# EAGLE design 04A-015 (EAGLE 9.6.2)
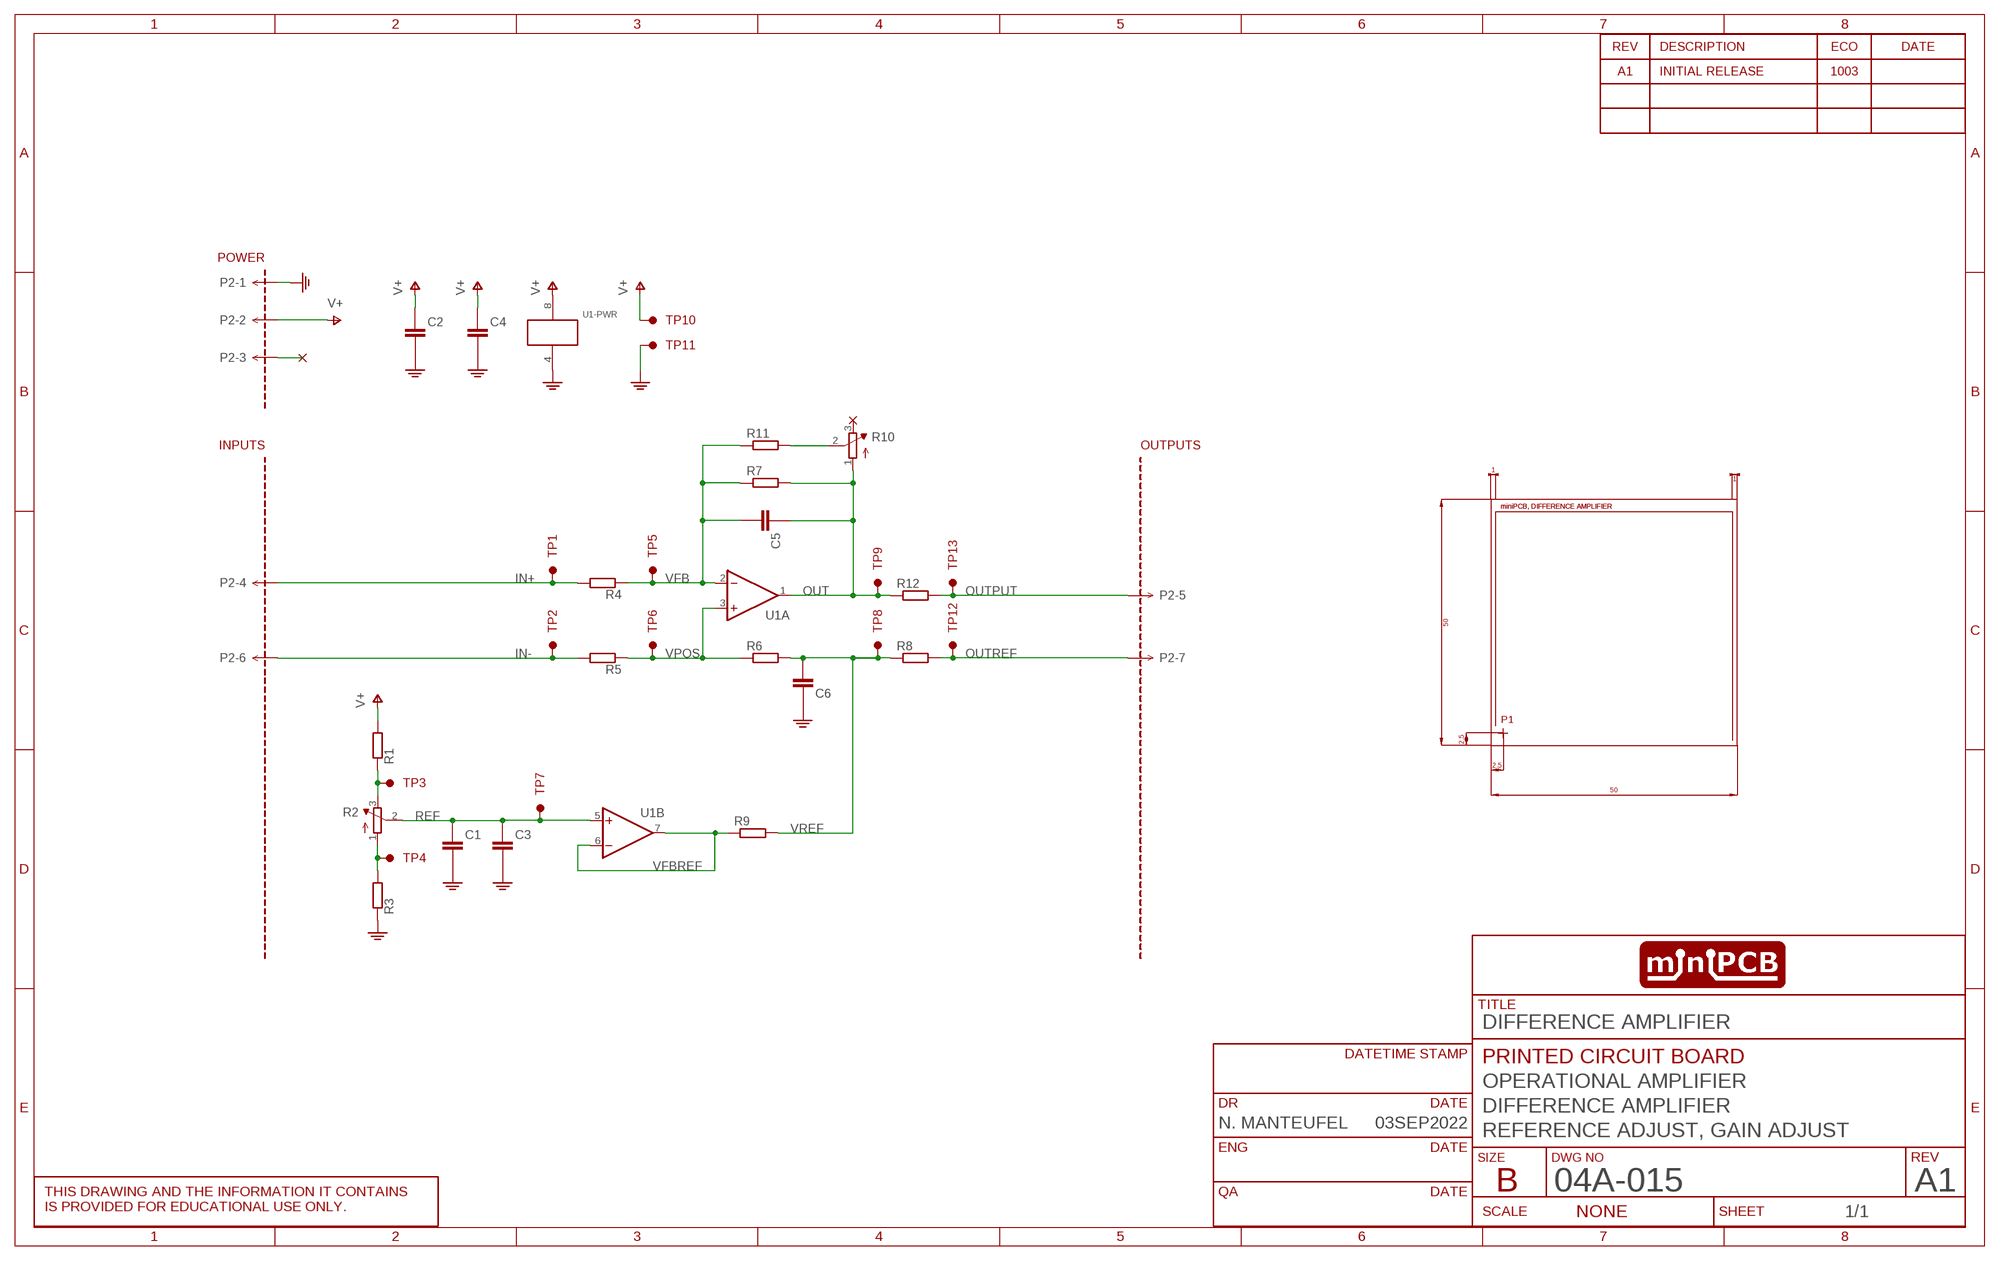
[diagram p0: schematic, sheet 1]
SHEET2 (SCHEMATIC): CIRCUIT_CATEGORY: OPERATIONAL AMPLIFIER; CIRCUIT_NAME: DIFFERENCE AMPLIFIER; CIRCUIT_VARIANT: REFERENCE ADJUST, GAIN ADJUST; DR: N. MANTEUFEL; DR_DATE: 03SEP2022; PCB_PCBA: PRINTED CIRCUIT BOARD; REVA: A1; REVA_ECO: 1003; REVISION: A1; TITLE: DIFFERENCE AMPLIFIER

## Parts
C1  CAPACITORTHD  [C050-024X044]
C2  CAPACITORTHD  [C050-024X044]
C3  CAPACITOR_10  [C5MM]
C4  CAPACITOR_10  [C5MM]
C5  CAPACITORTHD  [C050-024X044]
C6  CAPACITORTHD  [C050-024X044]
P2  MINIPCB_7P  [PINS_1X7]
R1  RESISTOR10MM  [0207/10]
R2  TRIMPOT0.100THD  [TRIM_0100]
R3  RESISTOR10MM  [0207/10]
R4  RESISTOR10MM  [0207/10]
R5  RESISTOR10MM  [0207/10]
R6  RESISTOR10MM  [0207/10]
R7  RESISTOR10MM  [0207/10]
R8  RESISTOR10MM  [0207/10]
R9  RESISTOR10MM  [0207/10]
R10  TRIMPOT0.100THD  [TRIM_0100]
R11  RESISTOR10MM  [0207/10]
R12  RESISTOR10MM  [0207/10]
TP1  TESTPOINTKE5000-SMTEXT  [PINS_1_TESTPOINT_KE5000_NOTEXT]
TP2  TESTPOINTKE5000-SMTEXT  [PINS_1_TESTPOINT_KE5000_NOTEXT]
TP3  TESTPOINTKE5000-SMTEXT  [PINS_1_TESTPOINT_KE5000_NOTEXT]
TP4  TESTPOINTKE5000-SMTEXT  [PINS_1_TESTPOINT_KE5000_NOTEXT]
TP5  TESTPOINTKE5000-SMTEXT  [PINS_1_TESTPOINT_KE5000_NOTEXT]
TP6  TESTPOINTKE5000-SMTEXT  [PINS_1_TESTPOINT_KE5000_NOTEXT]
TP7  TESTPOINTKE5000-SMTEXT  [PINS_1_TESTPOINT_KE5000_NOTEXT]
TP8  TESTPOINTKE5000-SMTEXT  [PINS_1_TESTPOINT_KE5000_NOTEXT]
TP9  TESTPOINTKE5000-SMTEXT  [PINS_1_TESTPOINT_KE5000_NOTEXT]
TP10  TESTPOINTKE5000-SMTEXT  [PINS_1_TESTPOINT_KE5000_NOTEXT]
TP11  TESTPOINTKE5000-SMTEXT  [PINS_1_TESTPOINT_KE5000_NOTEXT]
TP12  TESTPOINTKE5000-SMTEXT  [PINS_1_TESTPOINT_KE5000_NOTEXT]
TP13  TESTPOINTKE5000-SMTEXT  [PINS_1_TESTPOINT_KE5000_NOTEXT]
U1  OPAMP_DUALTHD  [DIL08]
U$1  CLASSIC-50  [PCB50]

## Nets
GND: C1.2(-) C2.2(-) C3.- C4.- C6.1(+) P2.1 R3.1 TP11.1 U1.4(-PWR:V-)
IN+: P2.4 R4.2 TP1.1
IN-: P2.6 R5.2 TP2.1
N$6: R10.2(S) R11.2
NC: P2.3
OUT: C5.1(+) R7.2 R10.1(A) R12.1 TP9.1 U1.1(A:OUT)
OUTPUT: P2.5 R12.2 TP13.1
OUTREF: P2.7 R8.2 TP12.1
P1.1: R2.1(A) R3.2 TP4.1
P1.3: R1.1 R2.3(E) TP3.1
REF: C1.1(+) C3.+ R2.2(S) TP7.1 U1.5(B:+IN)
V+: C2.1(+) C4.+ P2.2 R1.2 TP10.1 U1.8(-PWR:V+)
VFB: C5.2(-) R4.1 R7.1 R11.1 TP5.1 U1.2(A:-IN)
VFBREF: R9.1 U1.6(B:-IN) U1.7(B:OUT)
VPOS: R5.1 R6.1 TP6.1 U1.3(A:+IN)
VREF: C6.2(-) R6.2 R8.1 R9.2 TP8.1
Unconnected: R10.3(E)

## Library data of the parts
C1-C6 = minipcb:CAPACITOR
P2 = minipcb:MINIPCB_7P
R1 R3-R9 R11 R12 = minipcb:RESISTOR
R2 R10 = minipcb:TRIMPOT: SMT trimmer potentiometer part number TC33X http://www.ladyada.net/library/eagle
TP1-TP13 = minipcb:TESTPOINT
U1 = minipcb:OPAMP_DUAL: OP AMP
U$1 = miniPCB_BOARDS:CLASSIC; PART_NUMBER: 04A-015; REVISION: A1-01; TITLE: miniPCB, DIFFERENCE AMPLIFIER

## Board
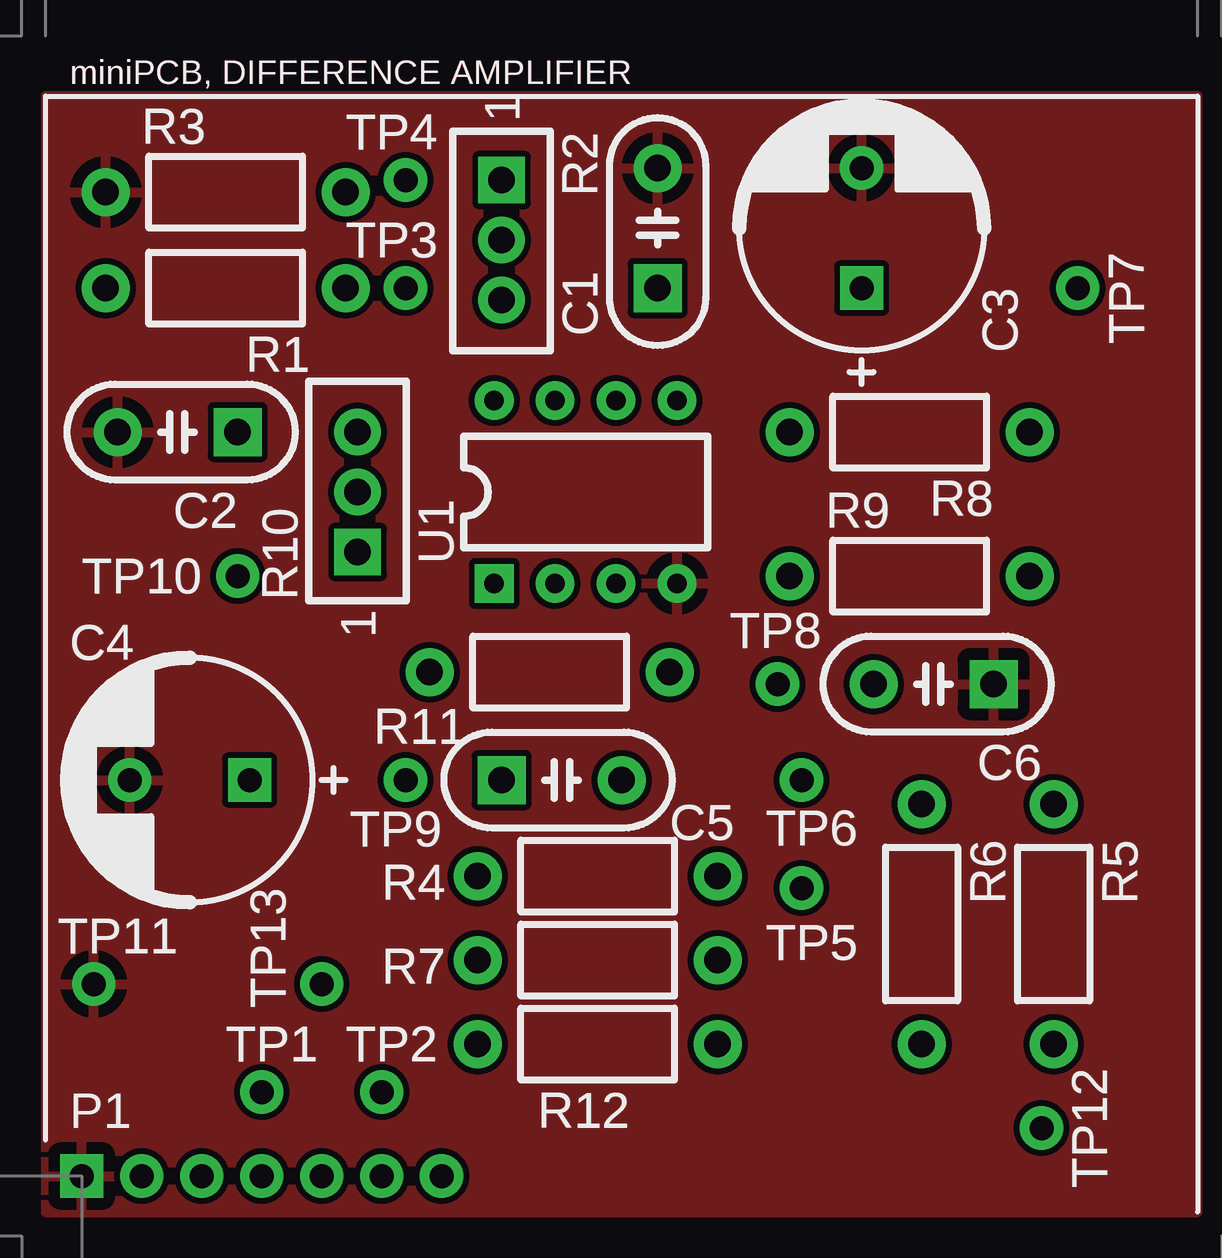
[diagram p1: board, top side]
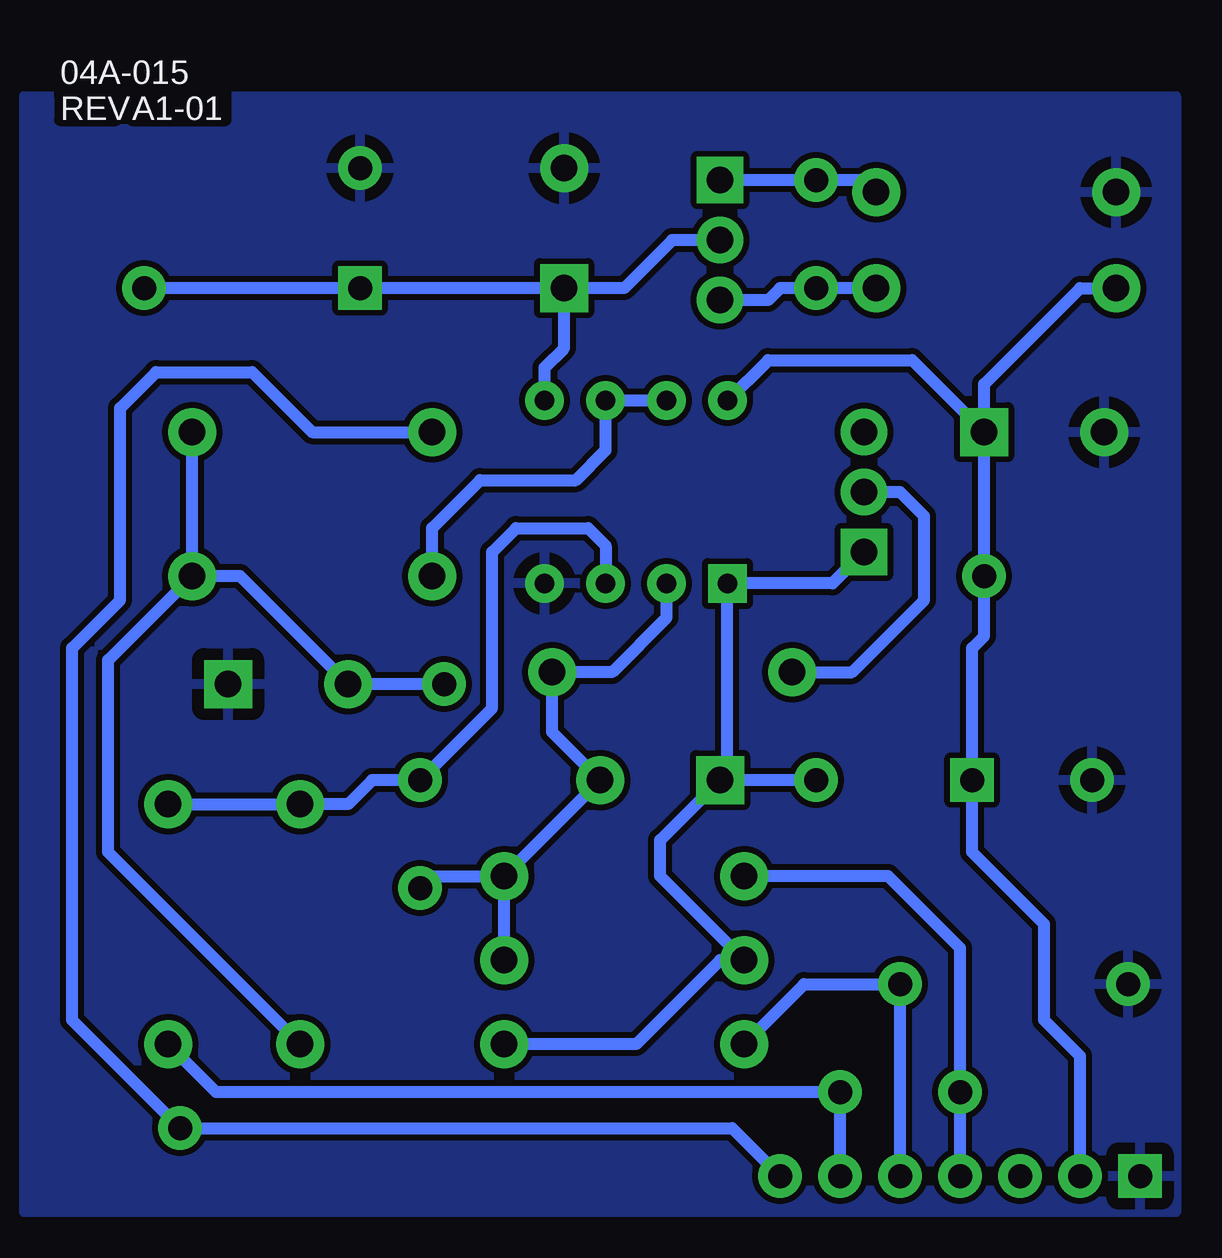
[diagram p2: board, bottom side, seen from below]

No outline drawn. Coordinates in mm, seen from the top.
Copper layers (1*16): Top 0.035mm / dielectric 1.5mm / Bottom 0.035mm
Design rules "minipcb": minimum track width 0.2mm, minimum drill 0.5mm, track to track 0.25mm, track to pad 0.5mm, pad to pad 0.5mm, via to via 0.5mm, smd to smd 0.15mm, copper to edge 1mm, drill to drill 1mm, minimum pad ring 0.4mm, minimum via ring 0.4mm, stop-mask expansion 0.1mm, vias tented up to drill 0.6mm, thermal gap 0.5mm

### Footprints (pad centres in the part's own frame; a part is rotated, then mirrored left to right if it is on the bottom)
C050-024X044 = drill 1.1 pad 2 square: 1 -2.5,0 | drill 1.1 pad 2: 2 2.5,0
C5MM = drill 1 square: + -2.5,0 | drill 1: - 2.5,0
PINS_1X7 = drill 1 square: 1 0,0 | drill 1: 2 2.5,0; 3 5,0; 4 7.5,0; 5 10,0; 6 12.5,0; 7 15,0
0207/10 = drill 1.1 pad 2: 1 -5,0; 2 5,0
TRIM_0100 = drill 1.1 pad 1.93 square: 1 0,0 | drill 1.1 pad 1.93: 2 2.5,0; 3 5,0
PINS_1_TESTPOINT_KE5000_NOTEXT = drill 1: 1 0,0
DIL08 = drill 0.813 square: 1 -3.81,-3.81 | drill 0.813: 2 -1.27,-3.81; 3 1.27,-3.81; 4 3.81,-3.81; 5 3.81,3.81; 6 1.27,3.81; 7 -1.27,3.81; 8 -3.81,3.81

### Placement (x,y rotation side)
C1  26.5,42 90 top
C2  6.5,33.5 180 top
C3  35,42 90 top
C4  7,19 180 top
C5  22.5,19 0 top
C6  38,23 180 top
P2  2.5,2.5 0 top
R1  8.5,39.5 180 top
R2  20,44 270 top
R3  8.5,43.5 0 top
R4  24,15 180 top
R5  43,13 270 top
R6  37.5,13 270 top
R7  24,11.5 180 top
R8  37,33.5 180 top
R9  37,27.5 0 top
R10  14,28.5 90 top
R11  22,23.5 180 top
R12  24,8 180 top
TP1  10,6 0 top
TP2  15,6 0 top
TP3  16,39.5 0 top
TP4  16,44 0 top
TP5  32.5,14.5 0 top
TP6  32.5,19 0 top
TP7  44,39.5 270 top
TP8  31.5,23 270 top
TP9  16,19 180 top
TP10  9,27.5 270 top
TP11  3,10.5 0 top
TP12  42.5,4.5 0 top
TP13  12.5,10.5 0 top
U1  23.5,31 0 top
U$1  0,0 0 top

### Tracks (layer width: path | path; a pad name or v marks a point on that pad's centre or on a via)
GND
  pour Top: 1,1 49,1 49,47.5 1,47.5
  pour Bottom: 1,1 49,1 49,47.5 1,47.5
IN+
  Bottom 0.5: P2.4 TP1.1 10,12 13,15 R4.2
IN-
  Bottom 0.5: P2.6 TP2.1 41,6 R5.2
N$6
  Bottom 0.5: R11.2 14.5,23.5 11.5,26.5 11.5,30 12.5,31 R10.2
OUT
  Bottom 0.5: R10.1 15.31,27.19 U1.1 19.69,19.31 C5.1 | C5.1 22.5,16.5 22.5,15 R7.2 20,11.5 23.5,8 R12.1 | TP9.1 C5.1
OUTPUT
  Bottom 0.5: R12.2 16.5,10.5 TP13.1 P2.5
OUTREF
  Bottom 0.5: P2.7 19.5,4.5 TP12.1 47,9 47,24.5 45,26.5 45,34.5 43.5,36 39.5,36 37,33.5 R8.2
P1.1
  Bottom 0.5: R3.2 14,44 TP4.1 R2.1
P1.3
  Bottom 0.5: R1.1 TP3.1 17.5,39.5 18,39 R2.3
REF
  Bottom 0.5: R2.2 22,41.5 24,39.5 C1.1 | U1.5 27.31,36.19 26.5,37 C1.1 | C1.1 C3.+ TP7.1
V+
  Bottom 0.5: P2.2 5,7.5 6.5,9 6.5,13 9.5,16 C4.+ 9.5,24.5 9,25 TP10.1 C2.1 | C2.1 9,35.5 5,39.5 R1.2 | U1.8 18,36.5 12,36.5 C2.1
VFB
  Bottom 0.5: U1.2 22.23,25.77 24.5,23.5 R11.1 27,21 C5.2 R4.1 | TP5.1 32,15 R4.1 | R7.1 R4.1
VFBREF
  Bottom 0.5: U1.7 U1.6 24.77,32.73 26,31.5 30,31.5 32,29.5 R9.1
VPOS
  Bottom 0.5: R5.1 R6.1 35.5,18 34.5,19 TP6.1 29.5,22 29.5,28.5 28.5,29.5 25.5,29.5 24.77,28.77 U1.3
VREF
  Bottom 0.5: TP8.1 C6.2 40,27.5 R9.2 | R9.2 R8.1 | R9.2 45.5,24 45.5,16 R6.2

### Text on the board
_tNames: R3 | R2 | TP4 | TP3 | TP7 | C3 | R1 | C1 | C2 | R8 | R9 | U1 | TP10 | R10 | TP8 | C4 | R11 | C6 | TP9 | C5 | TP6 | R6 | R5 | R4 | TP11 | TP5 | R7 | TP13 | TP1 | TP2 | R12 | TP12